# EAGLE schematic ESPDrum (EAGLE 7.7.0)
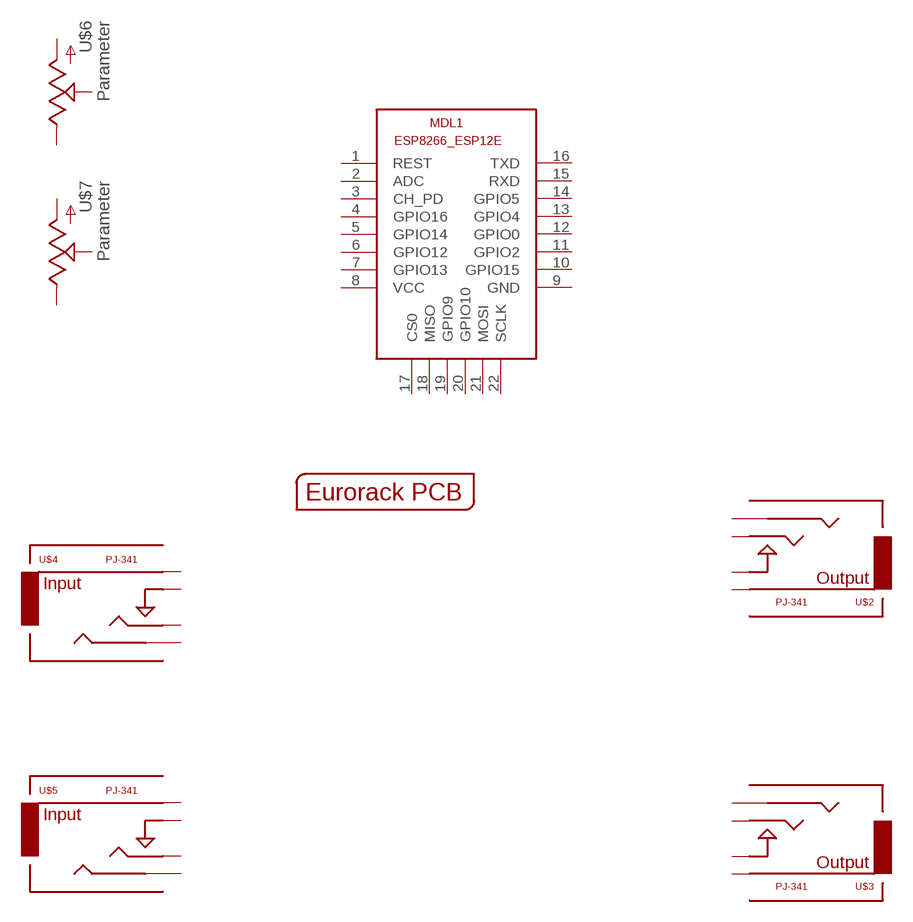
[diagram p0: schematic, sheet 1]

## Parts
MDL1  ESP8266-12EESP8266-ESP12E  [ESP8266-ESP12E]
U$1  EURORACK_PCB4HP  [EURORACK4HPPCB]
U$2  PJ-341  AUDIO-JACKOUTPUT  [3.5MM-JACK-SWITCH-13MM-OUTPUT]
U$3  PJ-341  AUDIO-JACKOUTPUT  [3.5MM-JACK-SWITCH-13MM-OUTPUT]
U$4  PJ-341  AUDIO-JACKINPUT  [3.5MM-JACK-SWITCH-13MM-INPUT]
U$5  PJ-341  AUDIO-JACKINPUT  [3.5MM-JACK-SWITCH-13MM-INPUT]
U$6  POTZEPHPOT  [OG-POTS_ALPS_POT_VERTICAL]
U$7  POTZEPHPOT  [OG-POTS_ALPS_POT_VERTICAL]
Unconnected: MDL1.1(REST) MDL1.2(ADC) MDL1.3(CH_PD) MDL1.4(GPIO16) MDL1.5(GPIO14) MDL1.6(GPIO12) MDL1.7(GPIO13) MDL1.8(VCC) MDL1.9(GND) MDL1.10(GPIO15) MDL1.11(GPIO2) MDL1.12(GPIO0) MDL1.13(GPIO4) MDL1.14(GPIO5) MDL1.15(RXD) MDL1.16(TXD) MDL1.17(CS0) MDL1.18(MISO) MDL1.19(GPIO9) MDL1.20(GPIO10) MDL1.21(MOSI) MDL1.22(SCLK) U$2.RING@3(RING) U$2.SECOND@3(SECOND) U$2.SWITCH@3(SWITCH) U$2.TIP@3(TIP) U$3.RING@3(RING) U$3.SECOND@3(SECOND) U$3.SWITCH@3(SWITCH) U$3.TIP@3(TIP) U$4.RING@3(RING) U$4.SECOND@3(SECOND) U$4.SWITCH@3(SWITCH) U$4.TIP@3(TIP) U$5.RING@3(RING) U$5.SECOND@3(SECOND) U$5.SWITCH@3(SWITCH) U$5.TIP@3(TIP) U$6.P$1(E) U$6.P$2(S) U$6.P$3(A) U$7.P$1(E) U$7.P$2(S) U$7.P$3(A)

## Library data of the parts
MDL1 = EurorackModularParts:ESP8266-12E: ESP8266-12E with additional I/O and GPIO04/05 corrected The author cannot warrant that this library is free from error or will meet your specific requirements. Created by PuceBaboon.com. Komagane, Nagano, JAPAN
U$1 = EurorackModularParts:EURORACK_PCB
U$2 U$3 = EurorackModularParts:AUDIO-JACK: Switching Mono 3.5mm Audio Jack from Erthenvar.; DESC: Output; MPN: PJ-341
U$4 U$5 = EurorackModularParts:AUDIO-JACK: Switching Mono 3.5mm Audio Jack from Erthenvar.; DESC: Input; MPN: PJ-341
U$6 U$7 = EurorackModularParts:POT; DESC: Parameter